# Altium schematic sheet Dice RGB - Sht 1.SchDoc: Dice RGB
size A4; Organization: PEI; Address1: 22 Russell Crescent; Address2: Western Heights; Address3: Rotorua; Address4: New Zealand 3015; DocumentNumber: N/A; Revision: 0; SheetNumber: 1; SheetTotal: 2
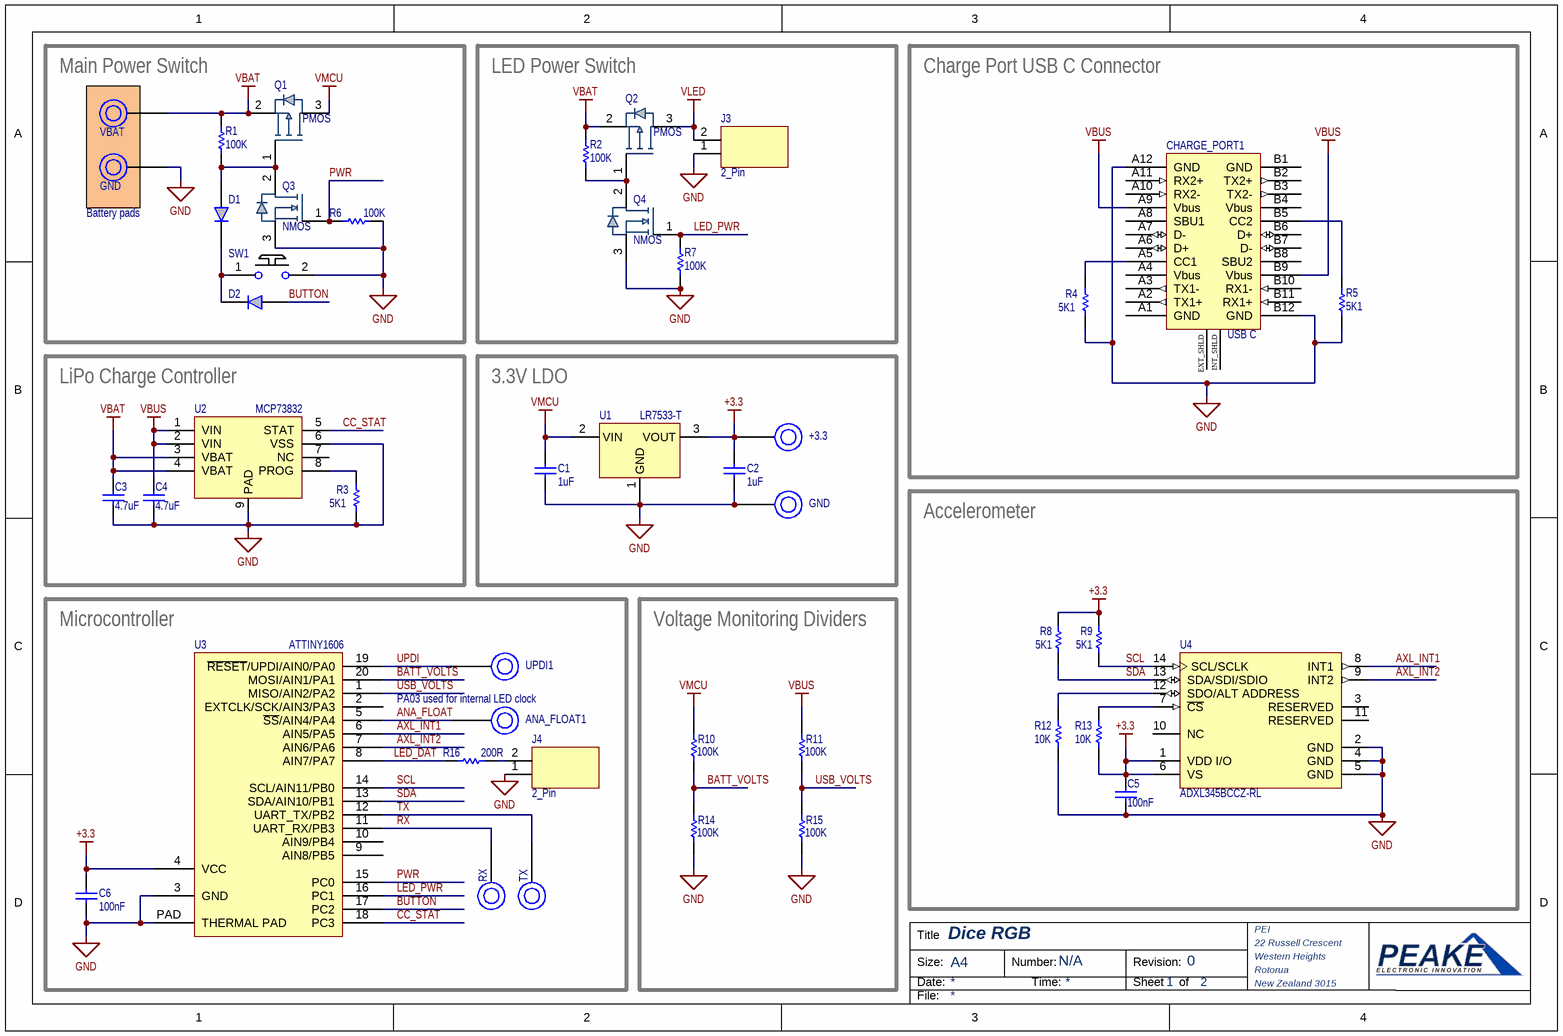
[diagram p0: Dice RGB - Sht 1.SchDoc]

## Parts
(Parts that share a designator on the sheet are numbered #1, #2 ... from top to bottom, then left to right.)
+3.3  Prog Pad  [Prog Pad 1mm]  (value not drawn)
ANA_FLOAT1  Prog Pad  [Prog Pad 1mm]  (value not drawn)
C1  value 1uF  [0603_CAP]  (hidden comment: Capacitor)
C2  value 1uF  [0603_CAP]  (hidden comment: Capacitor)
C3  value 4.7uF  [0603_CAP]  (hidden comment: Capacitor)
C4  value 4.7uF  [0603_CAP]  (hidden comment: Capacitor)
C5  value 100nF  [0603_CAP]  (hidden comment: Capacitor)
C6  value 100nF  [0603_CAP]  (hidden comment: Capacitor)
CHARGE_PORT1  USB C  [USB-TYPE-C-014]
D1  Diode  [SOD-523]  (value not drawn)
D2  Diode  [SOD-523]  (value not drawn)
GND#1  Prog Pad  [Prog Pad 1.5 x 2.5mm]  (value not drawn)
GND#2  Prog Pad  [Prog Pad 1mm]  (value not drawn)
J3  2_Pin  [2P 2mm PTH female header]
J4  2_Pin  [2P 2mm PTH female header]
Q1  PMOS  [SOT-23-PMOS]
Q2  PMOS  [SOT-23-PMOS]
Q3  NMOS  [SOT-23]
Q4  NMOS  [SOT-23]
R1  value 100K  [0603_RES]  (hidden comment: Resistor)
R2  value 100K  [0603_RES]  (hidden comment: Resistor)
R3  value 5K1  [0603_RES]  (hidden comment: Resistor)
R4  value 5K1  [0603_RES]  (hidden comment: Resistor)
R5  value 5K1  [0603_RES]  (hidden comment: Resistor)
R6  value 100K  [0603_RES]  (hidden comment: Resistor)
R7  value 100K  [0603_RES]  (hidden comment: Resistor)
R8  value 5K1  [0603_RES]  (hidden comment: Resistor)
R9  value 5K1  [0603_RES]  (hidden comment: Resistor)
R10  value 100K  [0603_RES]  (hidden comment: Resistor)
R11  value 100K  [0603_RES]  (hidden comment: Resistor)
R12  value 10K  [0603_RES]  (hidden comment: Resistor)
R13  value 10K  [0603_RES]  (hidden comment: Resistor)
R14  value 100K  [0603_RES]  (hidden comment: Resistor)
R15  value 100K  [0603_RES]  (hidden comment: Resistor)
R16  value 200R  [0603_RES]  (hidden comment: Resistor)
RX  Prog Pad  [Prog Pad 1mm]  (value not drawn)
SW1  Button  [PTS526 SK15 SMTR2 LFS SMD Tactile Push Button]  (value not drawn)
TX  Prog Pad  [Prog Pad 1mm]  (value not drawn)
U1  LR7533-T  [SOT-23]
U2  MCP73832  [8P 2x3 DFN]
U3  ATTINY1606  [20P 3x3 VQFN]
U4  ADXL345BCCZ-RL  [ADI-CC-14-1_V]
UPDI1  Prog Pad  [Prog Pad 1mm]  (value not drawn)
VBAT  Prog Pad  [Prog Pad 1.5 x 2.5mm]  (value not drawn)

## Blocks framed on the sheet
Main Power Switch: D1 D2 GND#1 Q1 Q3 R1 R6 SW1 VBAT
LED Power Switch: J3 Q2 Q4 R2 R7
Charge Port USB C Connector: CHARGE_PORT1 R4 R5
LiPo Charge Controller: C3 C4 R3 U2
3.3V LDO: +3.3 C1 C2 GND#2 U1
Accelerometer: C5 R8 R9 R12 R13 U4
Microcontroller: ANA_FLOAT1 C6 J4 R16 RX TX U3 UPDI1
Voltage Monitoring Dividers: R10 R11 R14 R15

## Nets
+3.3: +3.3.1 C2.2 C5.2 C6.2 R8.2 R9.2 R13.1 U1.3(VOUT) U3.4(VCC) U4.1(VDD_I/O) U4.6(VS)
GND: C1.1 C2.1 C3.1 C4.1 C5.1 C6.1 CHARGE_PORT1.A12(GND) CHARGE_PORT1.B12(GND) GND#1.1 GND#2.1 J3.1(GND) J4.1(GND) Q3.3(S) Q4.3(S) R3.1 R4.1 R5.1 R6.1 R7.1 R12.1 R14.1 R15.1 SW1.2 U1.1(GND) U2.6(VSS) U2.9(PAD) U3.3(GND) U3.PAD(THERMAL_PAD) U4.2(GND) U4.4(GND) U4.5(GND)
VBAT: C3.2 Q1.2(S) Q2.2(S) R1.2 R2.2 U2.3(VBAT) U2.4(VBAT) VBAT.1
VBUS: C4.2 CHARGE_PORT1.A9(Vbus) CHARGE_PORT1.B9(Vbus) R11.2 U2.1(VIN) U2.2(VIN)
VLED: J3.2(V+) Q2.3(D)
VMCU: C1.2 Q1.3(D) R10.2 U1.2(VIN)
ANA_FLOAT: ANA_FLOAT1.1 U3.5(~{SS}/AIN4/PA4)
AXL_INT1: U3.6(AIN5/PA5) U4.8(INT1)
AXL_INT2: U3.7(AIN6/PA6) U4.9(INT2)
BATT_VOLTS: R10.1 R14.2 U3.20(MOSI/AIN1/PA1)
BUTTON: D2.2(A) U3.17(PC2)
CC_STAT: U2.5(STAT) U3.18(PC3)
LED_DAT: R16.2 U3.8(AIN7/PA7)
LED_PWR: Q4.1(G) R7.2 U3.16(PC1)
PWR: Q3.1(G) R6.2 U3.15(PC0)
RX: RX.1 U3.11(UART_RX/PB3)
SCL: R9.1 U3.14(SCL/AIN11/PB0) U4.14(SCL/SCLK)
SDA: R8.1 U3.13(SDA/AIN10/PB1) U4.13(SDA/SDI/SDIO)
TX: TX.1 U3.12(UART_TX/PB2)
UPDI: U3.19(~{RESET}/UPDI/AIN0/PA0) UPDI1.1
USB_VOLTS: R11.1 R15.2 U3.1(MISO/AIN2/PA2)
NetCHARGE_PORT1_A5: CHARGE_PORT1.A5(CC1) R4.2
NetCHARGE_PORT1_B5: CHARGE_PORT1.B5(CC2) R5.2
NetD1_1: D1.1(K) D2.1(K) SW1.1
NetD1_2: D1.2(A) Q1.1(G) Q3.2(D) R1.1
NetJ4_2: J4.2(DAT) R16.1
NetQ2_1: Q2.1(G) Q4.2(D) R2.1
NetR3_2: R3.2 U2.8(PROG)
NetR12_2: R12.2 U4.12(SDO/ALT_ADDRESS)
NetR13_2: R13.2 U4.7(~{CS})

Not connected (* = marked no-connect by the designer): CHARGE_PORT1 A1(GND) A2(TX1+) A3(TX1-) A4(Vbus) A6(D+) A7(D-) A8(SBU1) A10(RX2-) A11(RX2+) B1(GND) B2(TX2+) B3(TX2-) B4(Vbus) B6(D+) B7(D-) B8(SBU2) B10(RX1-) B11(RX1+) EXT_SHLD INT_SHLD; U2 7(NC); U3 2(EXTCLK/SCK/AIN3/PA3) 9(AIN8/PB5) 10(AIN9/PB4); U4 3(RESERVED) 10(NC) 11(RESERVED)

## Notes on the sheet
- Battery pads
- (near ANA_FLOAT1) PA03 used for internal LED clock
- Title
- Size:
- Date:
- A4
- Number:
- Time:
- Revision:
- Sheet
- of
- File:

## Library data of the parts
+3.3 ANA_FLOAT1 GND#1 GND#2 RX TX UPDI1 VBAT = CMP-00044-1: Programmer pogo-pin interface pad (or test pad)
C1-C6 = CMP-001-00083-1: SMD Capacitor; Pins: 2; Source: Discrete.SchLib; Component Type: Standard; Design Item ID: Capacitor
CHARGE_PORT1 = CMP-00005-5: Vertical or RA Type C Usb Connector Rohs Compliant: Yes
D1 D2 = CMP-004-00031-3: SMD Diode; Design Item ID: Diode; Component Type: Standard; Source: Discrete.SchLib; Pins: 2
J3 J4 = CMP-002-00074-4: 2 Pin Connector; Source: Connectors.SchLib; Pins: 2; Component Type: Standard; Design Item ID: 2_Pin; MFN: *
Q1 Q2 = CMP-004-0033-1: P Channel MOSFET; MFN: BSS308PE; Source: P-MOS.SchLib; Component Type: Standard; Design Item ID: PMOS; Pin Count: 3
Q3 Q4 = CMP-004-0025-1: N Channel MOSFET; Pin Count: 3; Design Item ID: NMOS; Component Type: Standard; MFN: *; Source: N-MOS.SchLib
R1-R16 = CMP-009-00177-1: SMD Resistor; Component Type: Standard; Source: Discrete.SchLib; Design Item ID: Resistor; Pins: 2
SW1 = CMP-011-00013-4: Momentary push button; Design Item ID: Button; Pins: 2; Component Type: Standard; Source: Discrete.SchLib
U1 = CMP-00058-1: 55dB@1kHz 100mA 1.5uA -10℃~85℃ Fixed 3.3V~3.3V Positive 1 24V SOT-23-3 Linear Voltage Regulators (LDO) ROHS
U2 = CMP-00057-1: Battery Management Li-Ion/Li-Poly Charg Mgnt 4.2V Vreg out
U3 = CMP-00040-2: 8-bit AVR MCU, 16 KB, 1024 Bytes, 20 MHz, 1.8 to 5.5V, VQFN-20, RoHS; RoHS Compliant: Yes
U4 = CMP-010-00001-2: 3-Axis, +/-2 g / +/-4 g / +/-8 g / +/-16 g Digital Accelerometer with Digital Output, 1.6 KHz BW, -40 to 85 degC, 14-Pin LGA, Reel; Manufacturer: Analog Devices; Interface: Serial; Max Supply Voltage: 3.6V; Package Version: 03-16-2010-A, 03/2010; Min Supply Voltage: 2V; Nominal Supply Current: 140uA; Sensor Type: Motion; Nominal Supply Voltage: 2.5V; Package Quantity: 5000; Packaging: TapeandReel; Min Operating Temperature: -40°C; RoHS Compliant: True; Package Reference: CC-14-1; Max Operating Temperature: 85°C; Package Description: 14-Pin Land Grid Array, 3 x 5 mm Body, 0.8 mm Pitch; Datasheet URL: http://www.analog.com/static/imported-files/data_sheets/ADXL345.pdf; Pins: 14; Mounting Technology: SM; Case/Package: LGA; Datasheet Version: Rev. E, 06/2015